# EAGLE design ADSP-21477_or_21478_breakout_final (EAGLE 6.3)
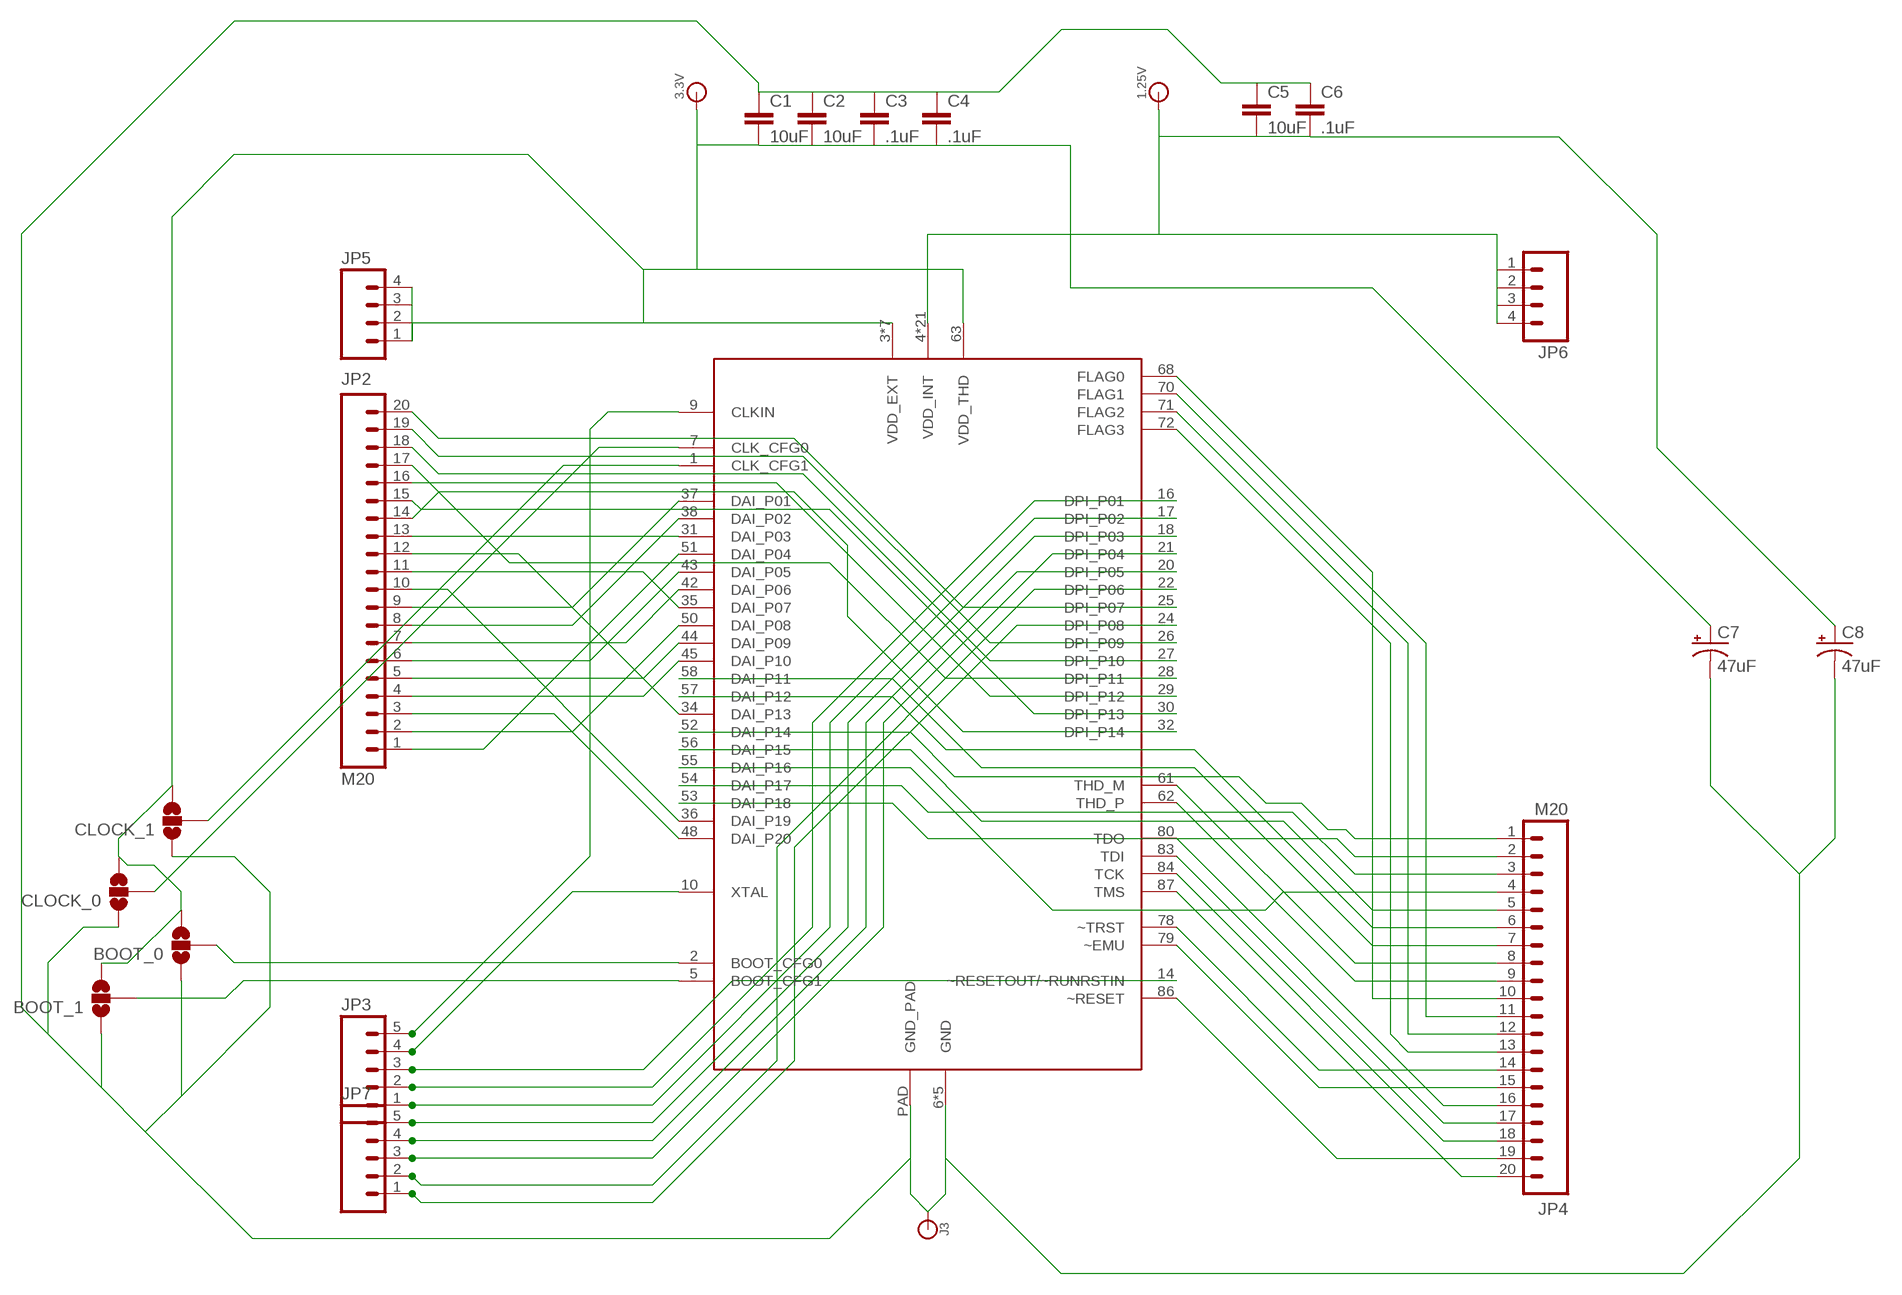
[diagram p0: schematic, sheet 1]

## Parts
1.25V  BANANA_CONN  [BANANA_CONN]
3.3V  BANANA_CONN  [BANANA_CONN]
BOOT_0  SOLDERJUMPER_2WAYS  [SJ_3]
BOOT_1  SOLDERJUMPER_2WAYS  [SJ_3]
C1  10uF  CAP0603-CAP  [0603-CAP]
C2  10uF  CAP0603-CAP  [0603-CAP]
C3  .1uF  CAP0603-CAP  [0603-CAP]
C4  .1uF  CAP0603-CAP  [0603-CAP]
C5  10uF  CAP0603-CAP  [0603-CAP]
C6  .1uF  CAP0603-CAP  [0603-CAP]
C7  47uF  47UF-TANT  [EIA3528]
C8  47uF  47UF-TANT  [EIA3528]
CLOCK_0  SOLDERJUMPER_2WAYS  [SJ_3]
CLOCK_1  SOLDERJUMPER_2WAYS  [SJ_3]
J3  BANANA_CONN  [BANANA_CONN]
JP2  M20  [1X20]
JP3  M05PTH  [1X05]
JP4  M20  [1X20]
JP5  M04PTH  [1X04]
JP6  M04PTH  [1X04]
JP7  M05PTH  [1X05]
U$1  ADSP-21479  [QFN-88]

## Nets
BOOT_CFG0: BOOT_0.2 U$1.2(BOOT_CFG0)
BOOT_CFG1: BOOT_1.2 U$1.5(BOOT_CFG1)
CLK_CFG0: CLOCK_0.2 U$1.7(CLK_CFG0)
CLK_CFG1: CLOCK_1.2 U$1.1(CLK_CFG1)
CLKIN: JP3.5 U$1.9(CLKIN)
DAI_P01: JP2.9 U$1.37(DAI_P01)
DAI_P02: JP2.8 U$1.38(DAI_P02)
DAI_P03: JP2.13 U$1.31(DAI_P03)
DAI_P04: JP2.1 U$1.51(DAI_P04)
DAI_P05: JP2.6 U$1.43(DAI_P05)
DAI_P06: JP2.7 U$1.42(DAI_P06)
DAI_P07: JP2.11 U$1.35(DAI_P07)
DAI_P08: JP2.2 U$1.50(DAI_P08)
DAI_P09: JP2.5 U$1.44(DAI_P09)
DAI_P10: JP2.4 U$1.45(DAI_P10)
DAI_P11: JP4.7 U$1.58(DAI_P11)
DAI_P12: JP4.6 U$1.57(DAI_P12)
DAI_P13: JP2.12 U$1.34(DAI_P13)
DAI_P14: JP4.1 U$1.52(DAI_P14)
DAI_P15: JP4.5 U$1.56(DAI_P15)
DAI_P16: JP4.4 U$1.55(DAI_P16)
DAI_P17: JP4.3 U$1.54(DAI_P17)
DAI_P18: JP4.2 U$1.53(DAI_P18)
DAI_P19: JP2.10 U$1.36(DAI_P19)
DAI_P20: JP2.3 U$1.48(DAI_P20)
DPI_P01: JP3.2 U$1.16(DPI_P01)
DPI_P02: JP3.1 U$1.17(DPI_P02)
DPI_P03: JP7.5 U$1.18(DPI_P03)
DPI_P04: JP7.3 U$1.21(DPI_P04)
DPI_P05: JP7.4 U$1.20(DPI_P05)
DPI_P06: JP7.2 U$1.22(DPI_P06)
DPI_P07: JP2.20 U$1.25(DPI_P07)
DPI_P08: JP7.1 U$1.24(DPI_P08)
DPI_P09: JP2.19 U$1.26(DPI_P09)
DPI_P10: JP2.18 U$1.27(DPI_P10)
DPI_P11: JP2.17 U$1.28(DPI_P11)
DPI_P12: JP2.16 U$1.29(DPI_P12)
DPI_P13: JP2.15 U$1.30(DPI_P13)
DPI_P14: JP2.14 U$1.32(DPI_P14)
FLAG0: JP4.10 U$1.68(FLAG0)
FLAG1: JP4.11 U$1.70(FLAG1)
FLAG2: JP4.12 U$1.71(FLAG2)
FLAG3: JP4.13 U$1.72(FLAG3)
GND: BOOT_0.1 BOOT_1.1 C1.1 C2.1 C3.1 C4.1 C5.1 C6.1 C7.C(-) C8.C(-) CLOCK_0.1 CLOCK_1.1 J3.P$1 U$1.6(GND) U$1.60(GND) U$1.73(GND) U$1.74(GND) U$1.76(GND) U$1.PAD(GND_PAD)
TCK: JP4.18 U$1.84(TCK)
TDI: JP4.17 U$1.83(TDI)
TDO: JP4.16 U$1.80(TDO)
THD_M: JP4.8 U$1.61(THD_M)
THD_P: JP4.9 U$1.62(THD_P)
TMS: JP4.20 U$1.87(TMS)
VDD_EXT+THD: 3.3V.P$1 BOOT_0.3 BOOT_1.3 C1.2 C2.2 C3.2 C4.2 C7.A(+) CLOCK_0.3 CLOCK_1.3 JP5.1 JP5.2 JP5.3 JP5.4 U$1.3(VDD_EXT) U$1.11(VDD_EXT) U$1.23(VDD_EXT) U$1.40(VDD_EXT) U$1.47(VDD_EXT) U$1.63(VDD_THD) U$1.75(VDD_EXT) U$1.81(VDD_EXT)
VDD_INT: 1.25V.P$1 C5.2 C6.2 C8.A(+) JP6.1 JP6.2 JP6.3 JP6.4 U$1.4(VDD_INT) U$1.8(VDD_INT) U$1.12(VDD_INT) U$1.13(VDD_INT) U$1.15(VDD_INT) U$1.19(VDD_INT) U$1.33(VDD_INT) U$1.39(VDD_INT) U$1.41(VDD_INT) U$1.46(VDD_INT) U$1.49(VDD_INT) U$1.59(VDD_INT) U$1.64(VDD_INT) U$1.65(VDD_INT) U$1.66(VDD_INT) U$1.67(VDD_INT) U$1.69(VDD_INT) U$1.77(VDD_INT) U$1.82(VDD_INT) U$1.85(VDD_INT) U$1.88(VDD_INT)
XTAL: JP3.4 U$1.10(XTAL)
~EMU: JP4.15 U$1.79(~EMU)
~RESET: JP4.19 U$1.86(~RESET)
~RESETOUT/~RUNRSTIN: JP3.3 U$1.14(~RESETOUT/~RUNRSTIN)
~TRST: JP4.14 U$1.78(~TRST)

## Library data of the parts
1.25V 3.3V J3 = SparkFun-Connectors:BANANA_CONN: Through-hole banana jack
BOOT_0 BOOT_1 CLOCK_0 CLOCK_1 = 1x05smd:SOLDERJUMPER_2WAY: Solder Jumper 2 way solder jumper
C1-C6 = 1x05smd:CAP: Capacitor Standard 0603 ceramic capacitor, and 0.1" leaded capacitor.
C7 C8 = SparkFun-Capacitors:47UF-TANT: 47uF Tantalum SMT CAP-08310- 10V 10% (EIA-3528); PROD_ID: CAP-08310
JP2 JP4 = SparkFun-Connectors:M20: 1x20 .1" header This is just like the LOCK variant in that the holes are staggared by 5 mil, but except for the last two holes. They are not altered from the "standard" footprint layout. This is used for a special purpose on the layout of our Graphic LCD Backpack. Make sure you want to use this device before selecting it for you project!
JP3 JP7 = SparkFun-Connectors:M05: Header 5 Standard 5-pin 0.1" header. Use with straight break away headers (SKU : PRT-00116), right angle break away headers (PRT-00553), swiss pins (PRT-00743), machine pins (PRT-00117), and female headers (PRT-00115). Molex polarized connector foot print use with SKU : PRT-08230 with associated crimp pins and housings.
JP5 JP6 = SparkFun-Connectors:M04: Header 4 Standard 4-pin 0.1" header. Use with straight break away headers (SKU : PRT-00116), right angle break away headers (PRT-00553), swiss pins (PRT-00743), machine pins (PRT-00117), and female headers (PRT-00115). Molex polarized connector foot print use with SKU : PRT-08231 with associated crimp pins and housings. 1MM SMD Version SKU: PRT-10208
U$1 = Strutz Electronic Industries:ADSP-21479

## Board
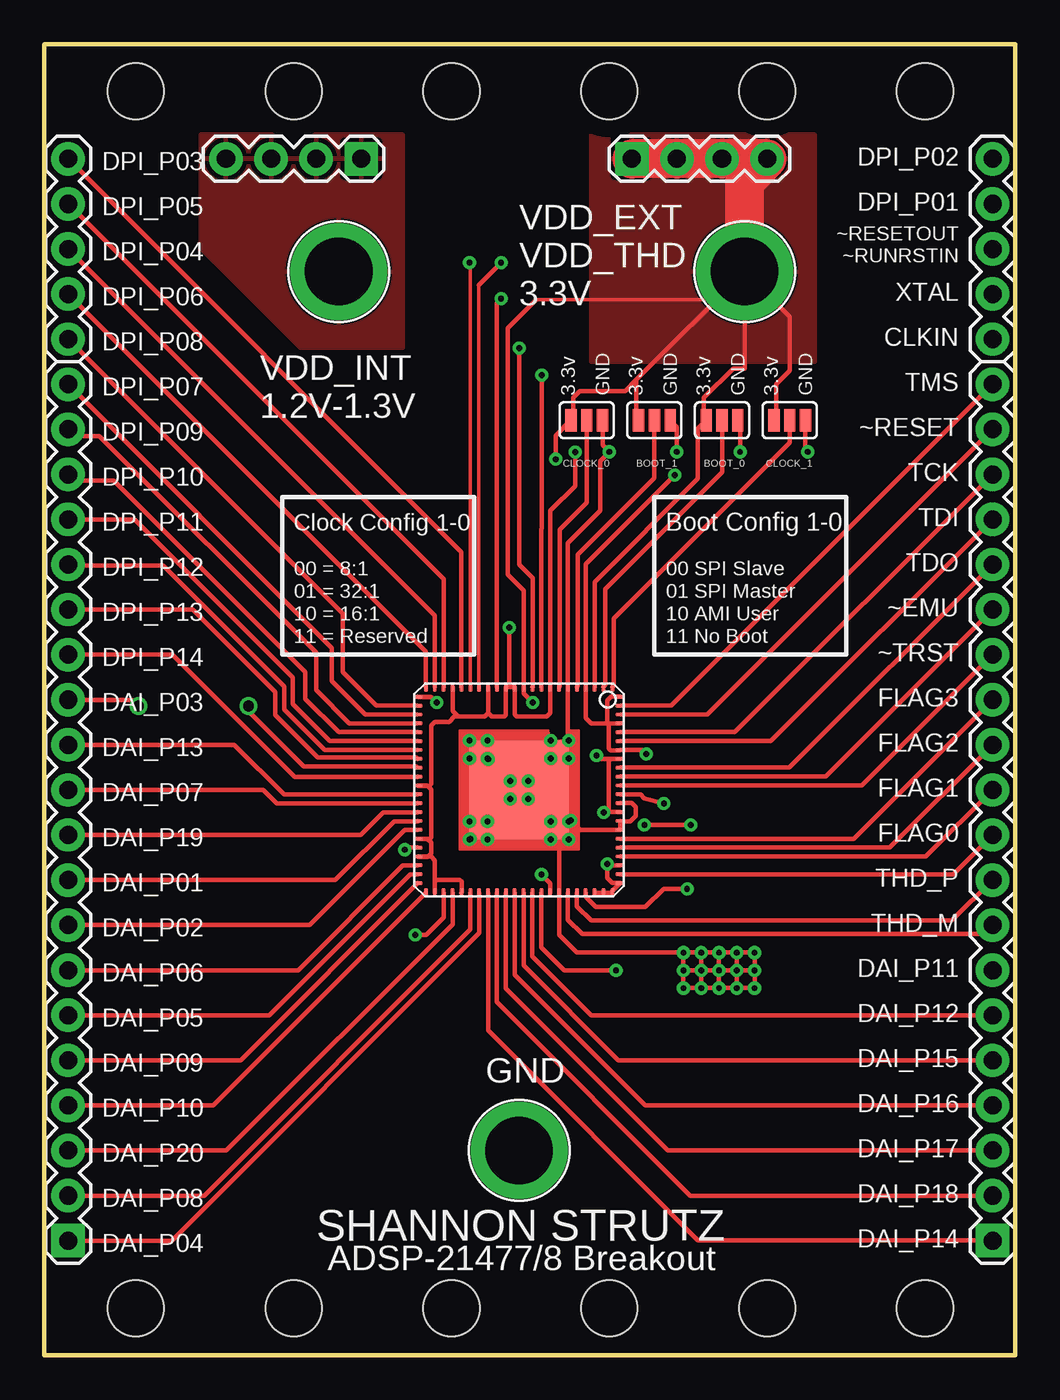
[diagram p1: board, top side]
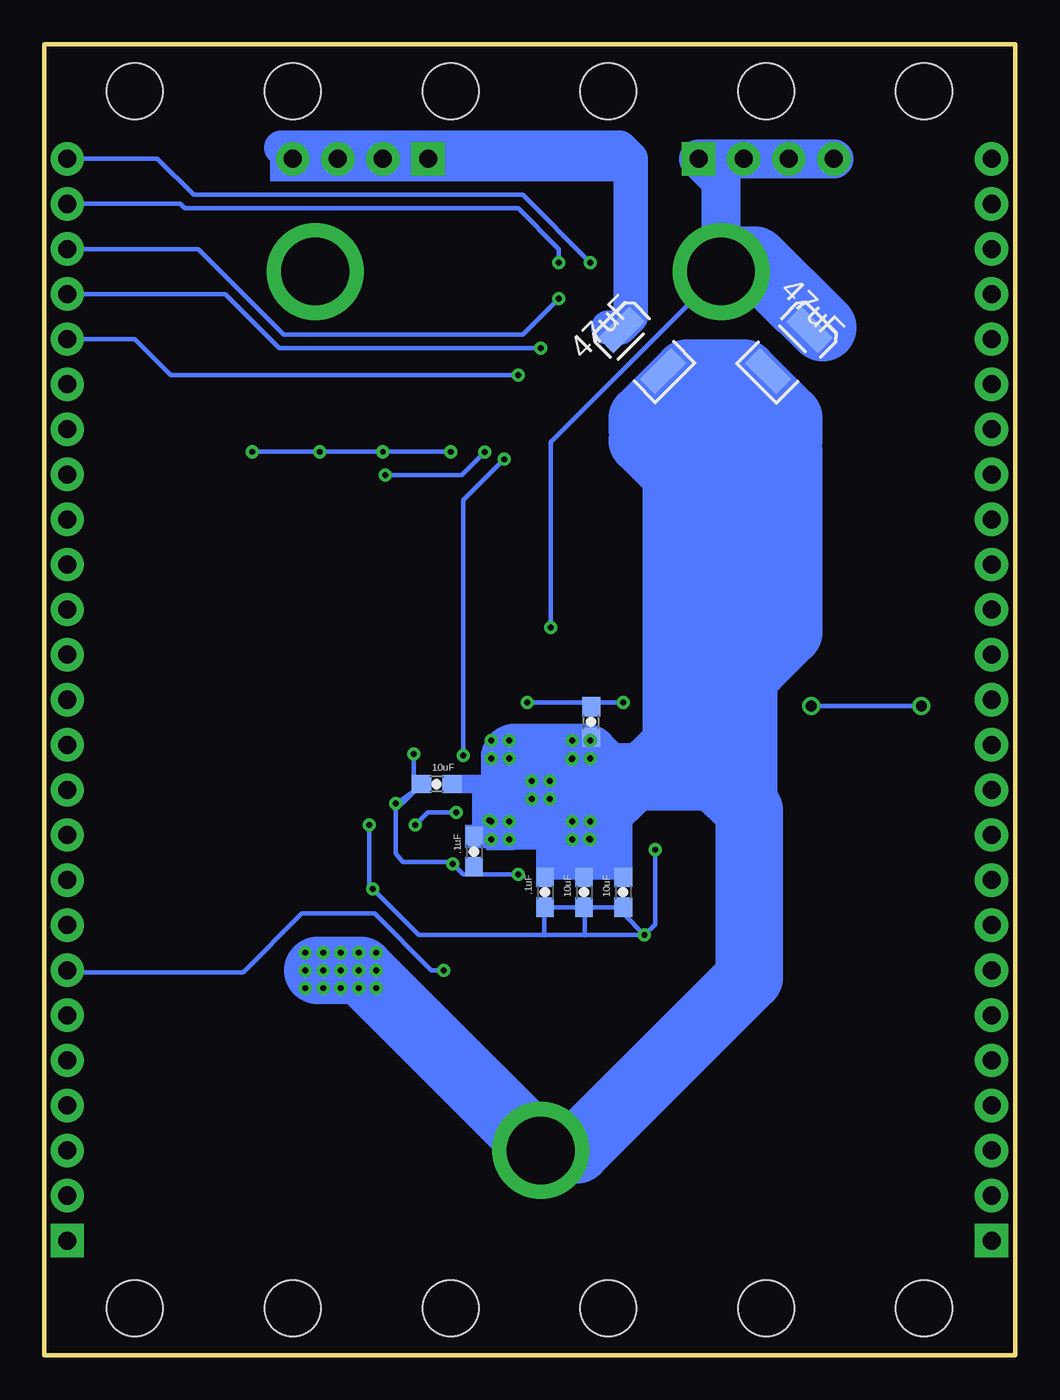
[diagram p2: board, bottom side, seen from below]

Size 54.7 x 73.86 mm. Coordinates in mm from the lower left corner, seen from the top.
Outline: 0,0 54.7,0 54.7,73.86 0,73.86 0,0
Copper layers (1*16): Top 0.035mm / dielectric 1.5mm / Bottom 0.035mm
Design rules "default": minimum track width 10mil, minimum drill 24mil, track to track 8mil, track to pad 8mil, pad to pad 8mil, via to via 8mil, smd to smd 8mil, copper to edge 40mil, drill to drill 8mil, minimum pad ring 10mil, minimum via ring 8mil, stop-mask expansion 4mil, vias tented up to drill 0mil, thermal gap 10mil
Holes 3.17 mm at 5.15,2.64 49.6,2.64 5.15,71.22 14.04,71.22 22.93,71.22 31.82,71.22 40.71,71.22 49.6,71.22 14.04,2.64 22.93,2.64 31.82,2.64 40.71,2.64

### Footprints (pad centres in the part's own frame; a part is rotated, then mirrored left to right if it is on the bottom)
BANANA_CONN = drill 3.81 pad 5.461: P$1 0,0
SJ_3 = smd 0.635 x 1.27: 1 -0.889,0; 2 0,0; 3 0.889,0
0603-CAP = smd 1.1 x 1: 1 -0.85,0; 2 0.85,0
EIA3528 = smd 1.2 x 2.5: A 1.65,0; C -1.65,0
1X20 = drill 1.016 pad 1.88 square: 1 0,0 | drill 1.016 pad 1.88: 2 2.54,0; 3 5.08,0; 4 7.62,0; 5 10.16,0; 6 12.7,0; 7 15.24,0; 8 17.78,0; 9 20.32,0; 10 22.86,0; 11 25.4,0; 12 27.94,0; 13 30.48,0; 14 33.02,0; 15 35.56,0; 16 38.1,0; 17 40.64,0; 18 43.18,0; 19 45.72,0; 20 48.26,0
1X05 = drill 1.016 pad 1.88: 1 0,0; 2 2.54,0; 3 5.08,0; 4 7.62,0; 5 10.16,0
1X04 = drill 1.016 pad 1.88 square: 1 0,0 | drill 1.016 pad 1.88: 2 2.54,0; 3 5.08,0; 4 7.62,0
QFN-88 = smd 0.55 x 0.23: 1 -5.8,5.25; 2 -5.8,4.75; 3 -5.8,4.25; 4 -5.8,3.75; 5 -5.8,3.25; 6 -5.8,2.75; 7 -5.8,2.25; 8 -5.8,1.75; 9 -5.8,1.25; 10 -5.8,0.75; 11 -5.8,0.25; 12 -5.8,-0.25; 13 -5.8,-0.75; 14 -5.8,-1.25; 15 -5.8,-1.75; 16 -5.8,-2.25; 17 -5.8,-2.75; 18 -5.8,-3.25; 19 -5.8,-3.75; 20 -5.8,-4.25; 21 -5.8,-4.75; 22 -5.8,-5.25; 45 5.8,-5.25; 46 5.8,-4.75; 47 5.8,-4.25; 48 5.8,-3.75; 49 5.8,-3.25; 50 5.8,-2.75; 51 5.8,-2.25; 52 5.8,-1.75; 53 5.8,-1.25; 54 5.8,-0.75; 55 5.8,-0.25; 56 5.8,0.25; 57 5.8,0.75; 58 5.8,1.25; 59 5.8,1.75; 60 5.8,2.25; 61 5.8,2.75; 62 5.8,3.25; 63 5.8,3.75; 64 5.8,4.25; 65 5.8,4.75; 66 5.8,5.25 | smd 0.23 x 0.55: 23 -5.25,-5.7; 24 -4.75,-5.7; 25 -4.25,-5.7; 26 -3.75,-5.7; 27 -3.25,-5.7; 28 -2.75,-5.7; 29 -2.25,-5.7; 30 -1.75,-5.7; 31 -1.25,-5.7; 32 -0.75,-5.7; 33 -0.25,-5.7; 34 0.25,-5.7; 35 0.75,-5.7; 36 1.25,-5.7; 37 1.75,-5.7; 38 2.25,-5.7; 39 2.75,-5.7; 40 3.25,-5.7; 41 3.75,-5.7; 42 4.25,-5.7; 43 4.75,-5.7; 44 5.25,-5.7; 67 5.25,5.7; 68 4.75,5.7; 69 4.25,5.7; 70 3.75,5.7; 71 3.25,5.7; 72 2.75,5.7; 73 2.25,5.7; 74 1.75,5.7; 75 1.25,5.7; 76 0.75,5.7; 77 0.25,5.7; 78 -0.25,5.7; 79 -0.75,5.7; 80 -1.25,5.7; 81 -1.75,5.7; 82 -2.25,5.7; 83 -2.75,5.7; 84 -3.25,5.7; 85 -3.75,5.7; 86 -4.25,5.7; 87 -4.75,5.7; 88 -5.25,5.7 | smd 5.588 x 5.588: PAD 0,0

### Placement (x,y rotation side)
1.25V  16.58,61.06 0 top
3.3V  39.44,61.06 0 top
BOOT_0  38.17,52.68 180 top
BOOT_1  34.36,52.68 180 top
C1  22.1,26.08 270 bottom
C2  24.3,26.08 270 bottom
C3  23.9,35.68 90 bottom
C4  26.5,26.08 270 bottom
C5  32.6,32.18 180 bottom
C6  30.5,28.38 270 bottom
C7  21.03,56.62 135 bottom
C8  12.77,56.62 45 bottom
CLOCK_0  30.55,52.68 180 top
CLOCK_1  41.98,52.68 180 top
J3  26.74,11.53 0 top
JP2  1.34,6.45 90 top
JP3  53.41,67.41 270 top
JP4  53.41,6.45 90 top
JP5  33.09,67.41 0 top
JP6  17.85,67.41 180 top
JP7  1.34,57.25 90 top
U$1  26.74,31.85 270 top

### Tracks (layer width: path | path; a pad name or v marks a point on that pad's centre or on a via)
BOOT_CFG0
  Top 0.254: 31.57,37.73 U$1.2 31.6,37.76 31.6,43.18 38.17,49.75 BOOT_0.2
BOOT_CFG1
  Top 0.254: BOOT_1.2 34.36,49.42 30.04,45.1 30.04,37.7 U$1.5
CLK_CFG0
  Top 0.254: CLOCK_0.2 30.55,48.04 29.03,46.51 29.03,37.69 U$1.7
CLK_CFG1
  Top 0.254: CLOCK_1.2 41.98,51.41 32.07,41.5 32.07,37.73 U$1.1
CLKIN  (via drill 0.33 pad 0.25)
  Top 0.254: U$1.9 27.99,46.56 28.01,46.58 v28.01,55.22
  Bottom 0.254: v28.01,55.22 47.57,55.22 49.6,57.25 JP3.5
DAI_P01
  Top 0.254: U$1.37 21.02,30.08 19.7,30.08 16.39,26.77 JP2.9
DAI_P02
  Top 0.254: U$1.38 21.02,29.58 20.3,29.58 14.95,24.23 JP2.8
DAI_P03  (via drill 0.6)
  Top 0.254: U$1.31 20.96,33.18 14.6,33.18 11.5,36.28 v11.5,36.58 | v5.3,36.58 4.95,36.93 JP2.13
  Bottom 0.254: v11.5,36.58 v5.3,36.58
DAI_P04
  Top 0.254: U$1.51 24.5,23.78 7.17,6.45 JP2.1
DAI_P05
  Top 0.254: U$1.43 21.02,27.08 20.6,27.08 12.67,19.15 JP2.6
DAI_P06
  Top 0.254: U$1.42 21.02,27.58 20.2,27.58 14.31,21.69 JP2.7
DAI_P07
  Top 0.254: U$1.35 21.02,31.08 13.1,31.08 12.33,31.85 JP2.11
DAI_P08
  Top 0.254: U$1.50 24,23.98 9.01,8.99 JP2.2
DAI_P09
  Top 0.254: U$1.44 11.05,16.61 JP2.5
DAI_P10
  Top 0.254: U$1.45 9.51,14.07 JP2.4
DAI_P11  (via drill 0.33 pad 0.25)
  Top 0.254: U$1.58 27.99,22.98 29.28,21.69 v32.19,21.69 v32.2,21.68
  Bottom 0.254: v32.2,21.68 32.9,21.68 36.1,24.88 40.2,24.88 43.5,21.58 53.3,21.58 JP4.7
DAI_P12
  Top 0.254: U$1.57 27.49,22.46 30.8,19.15 JP4.6
DAI_P13
  Top 0.254: U$1.34 21.02,31.58 13.5,31.58 10.69,34.39 JP2.12
DAI_P14
  Top 0.254: U$1.52 24.99,18.29 36.8,6.48 53.38,6.48 JP4.1
DAI_P15
  Top 0.254: U$1.56 26.99,21.95 32.33,16.61 JP4.5
DAI_P16
  Top 0.254: U$1.55 26.49,21.43 33.85,14.07 JP4.4
DAI_P17
  Top 0.254: U$1.54 25.99,20.66 35.12,11.53 JP4.3
DAI_P18
  Top 0.254: U$1.53 25.49,19.89 36.39,8.99 JP4.2
DAI_P19
  Top 0.254: U$1.36 21.02,30.58 19.1,30.58 17.83,29.31 JP2.10
DAI_P20
  Top 0.254: U$1.48 22.99,24.27 10.25,11.53 JP2.3
DPI_P01  (via drill 0.33 pad 0.25)
  Top 0.203: 24.45,60.3 24.45,37.69 U$1.16
  Top 0.254: v25.72,61.57 24.45,60.3
  Bottom 0.254: JP3.2 47.06,64.87 46.81,64.62 28.01,64.62 25.72,62.33 v25.72,61.57
DPI_P02  (via drill 0.33 pad 0.25)
  Top 0.203: U$1.17 23.99,61.52 v23.95,61.57
  Bottom 0.254: JP3.1 48.33,67.41 46.3,65.38 27.76,65.38 v23.95,61.57
DPI_P03
  Top 0.254: JP7.5 23.49,45.26 U$1.18
DPI_P04
  Top 0.254: JP7.3 21.99,41.68 U$1.21
DPI_P05
  Top 0.254: JP7.4 22.49,43.72 U$1.20
DPI_P06
  Top 0.254: JP7.2 21.49,39.64 U$1.22
DPI_P07
  Top 0.254: U$1.25 18.08,36.1 16.2,37.98 16.2,39.85 JP2.20
DPI_P08
  Top 0.254: U$1.24 18.68,36.6 16.8,38.48 16.8,41.79 JP7.1
DPI_P09
  Top 0.254: U$1.26 17.18,35.6 15.3,37.48 15.3,39.58 3.1,51.78 1.73,51.78 JP2.19
DPI_P10
  Top 0.254: U$1.27 16.58,35.1 14.7,36.98 14.7,38.48 3.9,49.28 1.69,49.28 JP2.18
DPI_P11
  Top 0.254: U$1.28 16.08,34.6 14,36.68 14,38.18 5.1,47.08 JP2.17
DPI_P12
  Top 0.254: U$1.29 15.78,34.1 13.5,36.38 13.5,37.68 6.7,44.48 1.41,44.48 JP2.16
DPI_P13
  Top 0.254: U$1.30 20.96,33.68 15.4,33.68 13,36.08 13,37.38 8.37,42.01 JP2.15
DPI_P14
  Top 0.254: U$1.32 21.02,32.58 14.1,32.58 7.21,39.47 JP2.14
FLAG0
  Top 0.254: U$1.68 51.2,27.1 JP4.10
FLAG1
  Top 0.254: U$1.70 49.66,28.1 JP4.11
FLAG2
  Top 0.254: U$1.71 47.62,28.6 JP4.12
FLAG3
  Top 0.254: U$1.72 45.58,29.1 JP4.13
GND  (via drill 0.33 pad 0.25)
  Top 0.254: CLOCK_0.1 31.44,51.28 v31.82,50.9 31.3,50.38 31.3,47.58 29.49,45.77 U$1.6 29.49,34.6 U$1.PAD | 35.63,52.17 35.63,52.3 BOOT_1.1 35.25,52.55 35.63,52.17 | 35.63,52.17 v35.63,50.9 | v39.19,50.9 39.19,52.55 BOOT_0.1 | CLOCK_1.1 42.87,51.03 v43,50.9 | U$1.PAD 27.93,31.85 29,30.78 | U$1.76 33.08,31.1 33.3,30.88 33.3,30.38 33,30.08 32.46,30.08 U$1.74 U$1.73 30.18,29.6 v29.65,30.13 | v29.65,30.13 29,30.78 | 29,30.78 28.99,30.77 U$1.60 28.99,23.69 30,22.68 v36,22.68 | v36,22.68 v37,22.68 | v38,22.68 v39,22.68 | v40,22.68 40.1,22.68 | v36,22.68 v36,21.68 | v37,20.68 v38,20.68 | v39,20.68 v40,20.68 v40,21.68 | v40,21.68 v40,22.68 | v40,22.68 v39,22.68 | v39,22.68 v39,21.68 | v39,21.68 v39,20.68 | v39,20.68 v38,20.68 | v38,20.68 v38,21.68 | v38,21.68 v38,22.68 | v38,22.68 v37,22.68 | v37,22.68 v37,21.68 | v37,21.68 v37,20.68 | v37,20.68 v36,20.68 v36,21.68 | v36,21.68 v37,21.68 | v37,21.68 v38,21.68 | v38,21.68 v39,21.68 | v39,21.68 v40,21.68 | v25,33.58 v25.01,33.58 U$1.PAD | v24,29.08 26.74,31.82 U$1.PAD | v29.65,30.13 29.1,30.68 27.7,30.68 26.74,31.64 U$1.PAD
  Bottom 0.254: v31.82,50.9 v35.63,50.9 v39.19,50.9 v43,50.9 | v36,22.68 v36,21.68 v36,20.68 35.9,20.58 37.1,20.58 38.2,21.68 | C3.1 23.9,34.68 v25,33.58 23.91,32.48 18.48,32.48 13.94,37.03 C8.C 19.02,55.45 19.12,55.34 19.75,55.34 C7.C | C1.1 C2.1 C4.1 24.35,29.08 v24,29.08 | C5.1 28.8,32.18 29.65,31.33 v29.65,30.13 29.65,30.08 C6.1
  Bottom 3.81: J3.P$1 36.89,21.68 v37,21.68 v38,21.68 38.2,21.68 v39,21.68 39.3,21.68
N$1
  Bottom 0.254: 24.26,24.99 24.26,23.66
N$2
  Bottom 0.254: 26.55,24.99 26.55,23.66
N$3
  Bottom 3.81: 21.03,52.17 21.03,52.8 18.48,55.34 15.31,55.34 12.77,52.8 12.77,51.53 17.85,51.53 | 19.12,35.02 19.12,49.63 21.03,51.53 17.85,51.53 | 17.85,51.53 14.68,48.36 15.95,48.36 16.58,47.73 16.58,39.47
N$4
  Bottom 3.81: 12.77,50.9 12.77,40.74 14.68,38.84 15.31,38.2 | 15.31,38.2 15.95,37.56 | 17.21,36.3 15.95,37.56 | 15.95,37.56 15.95,31.85 15.31,31.21 15.31,38.2 | 15.31,38.2 20.39,33.12
N$5
  Bottom 3.81: 15.95,61.7 14.68,61.7 10.87,57.88
N$6
  Bottom 1.93: 22.93,57.88 22.3,57.88 21.66,58.52 21.66,67.41 22.3,68.05 41.34,68.05
N$55  (via drill 0.33 pad 0.25)
  other vias: 26.23,32.36
N$56  (via drill 0.33 pad 0.25)
  other vias: 27.25,32.36
N$57  (via drill 0.33 pad 0.25)
  other vias: 27.25,31.34
N$58  (via drill 0.33 pad 0.25)
  other vias: 26.23,31.34
N$59  (via drill 0.33 pad 0.25)
  other vias: 23.95,29.06
N$60  (via drill 0.33 pad 0.25)
  other vias: 23.95,30.07
N$61  (via drill 0.33 pad 0.25)
  other vias: 24.96,30.07
N$62  (via drill 0.33 pad 0.25)
  other vias: 24.96,29.06
N$63  (via drill 0.33 pad 0.25)
  other vias: 29.53,29.06
N$64  (via drill 0.33 pad 0.25)
  other vias: 28.52,29.06
N$65  (via drill 0.33 pad 0.25)
  other vias: 28.52,30.07
N$66  (via drill 0.33 pad 0.25)
  other vias: 29.53,30.07
N$67  (via drill 0.33 pad 0.25)
  other vias: 23.95,34.64
N$68  (via drill 0.33 pad 0.25)
  other vias: 24.96,34.64
N$69  (via drill 0.33 pad 0.25)
  other vias: 24.96,33.63
N$70  (via drill 0.33 pad 0.25)
  other vias: 23.95,33.63
N$71  (via drill 0.33 pad 0.25)
  other vias: 29.53,34.64
N$72  (via drill 0.33 pad 0.25)
  other vias: 29.53,33.63
N$73  (via drill 0.33 pad 0.25)
  other vias: 28.52,33.63
N$74  (via drill 0.33 pad 0.25)
  other vias: 28.52,34.64
N$75
  Bottom 3.81: 26.8,11.58 24.7,11.58 15,21.28 15,30.68 16.9,32.58 21.6,32.58 | 21.6,32.58 23.1,32.58 24.2,33.68 28.2,33.68 28.2,30.38 23.8,30.38 21.6,32.58
TCK
  Top 0.254: U$1.84 38.88,35.1 JP4.18
TDI
  Top 0.254: U$1.83 40.92,34.6 JP4.17
TDO
  Top 0.254: U$1.80 41.96,33.1 JP4.16
THD_M
  Top 0.254: U$1.61 29.49,24.53 30.3,23.72 52.9,23.72 JP4.8 53.16,23.98
THD_P
  Top 0.254: U$1.62 29.99,25.3 30.8,24.48 51.12,24.48 JP4.9
TMS
  Top 0.254: U$1.87 35.3,36.6 JP4.20
VDD_EXT+THD  (via drill 0.33 pad 0.25)
  Top 0.203: v27.5,36.78 27.5,36.8 27.02,37.29 27.02,43.08 26.11,43.99 26.11,57.88 27.71,59.48 37.86,59.48 3.3V.P$1
  Top 0.254: 33.34,54.96 32.71,54.33 30.17,54.33 29.79,53.95 29.79,52.8 CLOCK_0.3 28.8,51.82 v28.8,50.48 | U$1.63 30.49,25.81 31.06,25.25 33.85,25.25 34.89,26.28 v36.2,26.28 | 33.34,54.96 33.34,52.8 BOOT_1.3 | CLOCK_1.3 41.22,52.8 41.22,54.71 41.98,55.47 41.98,58.52 3.3V.P$1 | U$1.75 31.88,30.6 | 31.88,30.6 31.8,30.68 31.8,33.48 31.9,33.58 | 31.9,33.58 32.42,33.58 U$1.81 | U$1.11 26.99,37.29 27,37.28 | v22.1,36.78 21.8,37.08 21.06,37.08 U$1.23 | 31.88,30.6 31.52,30.6 v31.5,30.58 | v33.8,29.88 v36.4,29.88 | U$1.40 20.42,28.6 v20.3,28.48 | 22.49,24.67 22.5,24.68 U$1.47 22.49,24.67 | 22.49,24.67 21.5,23.68 v20.9,23.68 | v27.5,36.78 27,37.28 | 27,37.28 27,43.08 26.1,43.98 26.1,57.88 27.7,59.48 | U$1.3 30.99,43.57 36.8,49.38 36.8,52.2 BOOT_0.3 37.15,52.8 37.15,53.95 38.8,55.6 39.44,55.6 3.3V.P$1 | 31.9,33.58 31.3,33.58 v31.1,33.78 | 33.34,54.96 3.3V.P$1
  Top 2.184: 3.3V.P$1 39.44,66.14 JP5.4 JP5.3 JP5.2 JP5.1
  Bottom 0.254: v27.5,36.78 24,36.78 | 24,36.78 v22.1,36.78 | v31.5,30.58 33.1,30.58 v33.8,29.88 | v36.4,29.88 36.4,26.48 v36.2,26.28 33.6,23.68 v20.9,23.68 | v20.3,28.48 20.3,24.28 v20.9,23.68 | v31.1,33.78 31.1,48.18 v28.8,50.48 | C3.2 23.9,36.68 24,36.78 | C4.2 C2.2 C1.2 22.1,24.88 v20.9,23.68 | C7.A 22.19,66.67 22.93,67.41 JP5.1
  pour Top: 43.4,55.98 30.8,55.98 30.8,68.78 43.4,68.78
VDD_INT  (via drill 0.33 pad 0.25)
  Top 0.254: U$1.13 U$1.12 26.49,36.09 26.6,35.98 28.3,35.98 28.5,36.18 U$1.8 | U$1.64 U$1.65 U$1.66 31.99,26.15 U$1.67 31.98,26.6 31.7,26.88 31.7,27.58 | v26.19,40.99 26.19,37.85 U$1.13 | U$1.19 22.99,36.29 23.3,35.98 | 23.3,35.98 24.8,35.98 25,36.18 U$1.15 24.99,36.19 25.2,35.98 25.9,35.98 26,36.08 U$1.13 | U$1.8 | 31.8,35.58 30.8,35.58 30.49,35.89 U$1.4 30.49,44.57 v35.5,49.58 | U$1.85 32.42,35.58 31.8,35.58 | U$1.88 31.92,37.1 31.7,36.88 31.7,35.68 31.8,35.58 | 31.8,35.58 31.8,34.18 31.9,34.08 32.42,34.08 U$1.82 33.68,34.1 v33.9,33.88 | v34.9,31.08 33.8,31.38 33.6,31.58 32.46,31.58 U$1.77 | 31.7,27.58 v31.7,27.68 31.78,27.6 U$1.69 31.72,27.6 31.7,27.58 | U$1.59 28.49,26.59 v28,27.08 | 23.3,35.98 23.1,35.98 22.8,35.68 22,35.68 21.8,35.48 21.8,32.18 21.7,32.08 21.06,32.08 U$1.33 21.58,32.1 21.8,31.88 21.8,29.18 21.7,29.08 21.06,29.08 U$1.39 21.58,29.1 21.8,28.88 21.8,28.28 21.6,28.08 21.06,28.08 U$1.41 21.78,28.1 22,27.88 U$1.46 21.99,26.67 22.1,26.78 23.4,26.78 23.5,26.68 U$1.49 | U$1.8 28.5,47.58 29.9,48.98 v29.9,50.88
  Bottom 0.254: v33.9,33.88 33.9,31.78 v34.9,31.08 | v34.9,31.08 34.9,28.28 34.5,27.78 31.5,27.78 31.6,27.68 v31.7,27.68 31.1,27.08 30.6,27.08 | v28,27.08 30.6,27.08 | v26.19,40.99 26.19,51.07 26.18,51.26 26.19,51.45 1.25V.P$1 13.3,57.78 C8.A | v29.9,50.88 31.2,49.58 v35.5,49.58 | C6.2 30.6,27.43 30.6,27.08 | C5.2 34.55,31.08 v34.9,31.08
  Bottom 2.184: 1.25V.P$1 16.58,66.14 JP6.1 JP6.2 JP6.3 JP6.4
  pour Top: 20.2,68.78 20.2,56.78 14.4,56.78 8.8,62.38 8.8,68.78
XTAL  (via drill 0.33 pad 0.25)
  Top 0.254: v26.74,56.74 26.74,44.55 27.5,43.79 27.5,37.66 U$1.10
  Bottom 0.254: JP3.4 44.52,59.79 41.47,56.74 v26.74,56.74
~EMU
  Top 0.254: U$1.79 44,32.6 JP4.15
~RESET
  Top 0.254: U$1.86 37.34,36.1 JP4.19
~RESETOUT/~RUNRSTIN  (via drill 0.33 pad 0.25)
  Top 0.254: v25.72,59.54 25.47,59.28 25.47,37.67 U$1.14
  Bottom 0.254: JP3.3 46.04,62.33 41.22,57.5 27.76,57.5 v25.72,59.54
~TRST
  Top 0.254: U$1.78 46.04,32.1 JP4.14
(copper drawn outside any net)
  shapes: Bottom area x11

### Text on the board
_tsilk: DPI_P02 | DPI_P03 | DPI_P01 | DPI_P05 | ~RESETOUT / ~RUNRSTIN | DPI_P04 | XTAL | DPI_P06 | VDD_EXT / VDD_THD / 3.3V | CLKIN | DPI_P08 | TMS | DPI_P07 | 3.3v | GND | 3.3v | GND | 3.3v | GND | 3.3v | GND | VDD_INT / 1.2V-1.3V | ~RESET | DPI_P09 | TCK | DPI_P10 | TDI | DPI_P11 | Clock Config 1-0 | Boot Config 1-0 | TDO | DPI_P12 | 00 = 8:1 | 00 SPI Slave | 01 = 32:1 | 01 SPI Master | ~EMU | DPI_P13 | 10 = 16:1 | 10 AMI User | 11 = Reserved | 11 No Boot | ~TRST | DPI_P14 | FLAG3 | DAI_P03 | FLAG2 | DAI_P13 | FLAG1 | DAI_P07 | FLAG0 | DAI_P19 | THD_P | DAI_P01 | THD_M | DAI_P02 | DAI_P11 | DAI_P06 | DAI_P12 | DAI_P05 | DAI_P15 | DAI_P09 | GND | DAI_P16 | DAI_P10 | DAI_P17 | DAI_P20 | DAI_P18 | DAI_P08 | DAI_P14 | DAI_P04 | SHANNON STRUTZ | ADSP-21477/8 Breakout